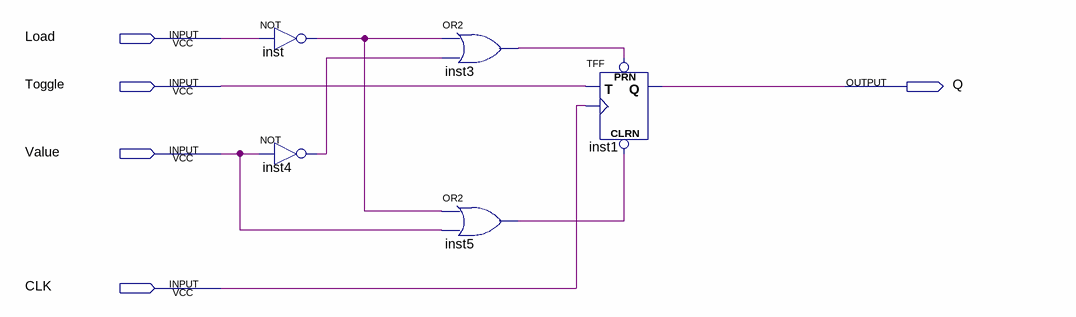
[diagram p0: schematic sheet]
// Quartus schematic TFF_KoCuBo.bdf as structural Verilog: 5 symbols, 5 pins
module TFF_KoCuBo (
  input  Load,
  input  Toggle,
  input  Value,
  input  CLK,
  output Q
);

  wire inst3_out, inst4_out, inst5_out, inst_out;

  not inst (inst_out, Load);
  not inst4 (inst4_out, Value);
  or inst3 (inst3_out, inst_out, inst4_out);
  or inst5 (inst5_out, inst_out, Value);
  TFF inst1 (.PRN(inst3_out), .CLRN(inst5_out), .T(Toggle), .CLK(CLK), .Q(Q));
endmodule
